# Altium schematic sheet Sheet1.SchDoc: <page title>
size Letter; Author: JRL; Organization: Engenuics Technologies Inc; Address1: 1835 19 Avenue NW; Address2: Calgary, AB  T2M 1B6; Address3: CANADA; Address4: 1-403-998-1422; DocumentNumber: <PPPP-DTTT->; Revision: <###>; SheetNumber: <x>; SheetTotal: <y>
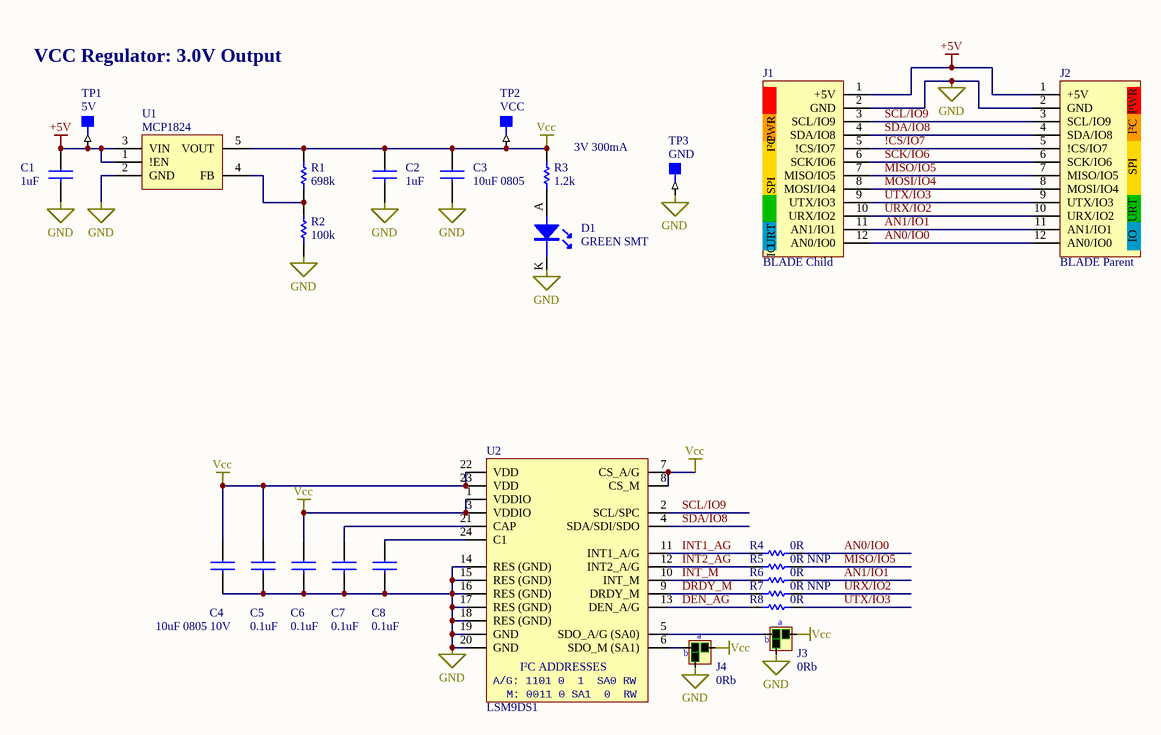
[diagram p0: Sheet1.SchDoc]

## Parts
C1  1uF  [0603]
C2  1uF  [0603]
C3  10uF 0805  [0805]
C4  10uF 0805 10V  [0805]
C5  0.1uF  [0603]
C6  0.1uF  [0603]
C7  0.1uF  [0603]
C8  0.1uF  [0603]
D1  GREEN SMT  [0603 AK]
J1  BLADE Child  [HDR1X12 ENGENUICS CHILD]
J2  BLADE Parent  [HDR1X12 ENGENUICS PARENT]
J3  0Rb  [0603 SELECTOR]
J4  0Rb  [0603 SELECTOR]
R1  698k  [0603]
R2  100k  [0603]
R3  1.2k  [0603]
R4  0R  [0603]
R5  0R NNP  [0603]
R6  0R  [0603]
R7  0R NNP  [0603]
R8  0R  [0603]
TP1  5V  [TEST POINT SMT]
TP2  VCC  [TEST POINT SMT]
TP3  GND  [TEST POINT SMT]
U1  MCP1824  [SOT23-5]
U2  LSM9DS1  [LGA24 3.5 x 3mm LSM9DS1]

## Nets
+5V: C1.1 J1.1(+5V) J2.1(+5V) TP1.1 U1.1(!EN) U1.3(VIN)
GND: C1.2 C2.2 C3.2 C4.2 C5.2 C6.2 C7.2 C8.2 D1.K(K1) J1.2(GND) J2.2(GND) J3.3(OUT2) J4.3(OUT2) R2.2 TP3.1 U1.2(GND) U2.14(RES_(GND)) U2.15(RES_(GND)) U2.16(RES_(GND)) U2.17(RES_(GND)) U2.18(RES_(GND)) U2.19(GND) U2.20(GND)
Vcc: C2.1 C3.1 C4.1 C5.1 C6.1 J3.2(OUT1) J4.2(OUT1) R1.2 R3.2 TP2.1 U1.5(VOUT) U2.1(VDDIO) U2.3(VDDIO) U2.7(CS_A/G) U2.8(CS_M) U2.22(VDD) U2.23(VDD)
!CS/IO7: J1.5(!CS/IO7) J2.5(!CS/IO7)
AN0/IO0: J1.12(AN0/IO0) J2.12(AN0/IO0) R4.1
AN1/IO1: J1.11(AN1/IO1) J2.11(AN1/IO1) R6.1
DEN_AG: R8.2 U2.13(DEN_A/G)
DRDY_M: R7.2 U2.9(DRDY_M)
INT1_AG: R4.2 U2.11(INT1_A/G)
INT2_AG: R5.2 U2.12(INT2_A/G)
INT_M: R6.2 U2.10(INT_M)
MISO/IO5: J1.7(MISO/IO5) J2.7(MISO/IO5) R5.1
MOSI/IO4: J1.8(MOSI/IO4) J2.8(MOSI/IO4)
SCK/IO6: J1.6(SCK/IO6) J2.6(SCK/IO6)
SCL/IO9: J1.3(SCL/IO9) J2.3(SCL/IO9) U2.2(SCL/SPC)
SDA/IO8: J1.4(SDA/IO8) J2.4(SDA/IO8) U2.4(SDA/SDI/SDO)
URX/IO2: J1.10(URX/IO2) J2.10(URX/IO2) R7.1
UTX/IO3: J1.9(UTX/IO3) J2.9(UTX/IO3) R8.1
NetC7_1: C7.1 U2.21(CAP)
NetC8_1: C8.1 U2.24(C1)
NetD1_A: D1.A(A1) R3.1
NetJ3_1: J3.1(IN) U2.5(SDO_A/G_(SA0))
NetJ4_1: J4.1(IN) U2.6(SDO_M_(SA1))
NetR1_1: R1.1 R2.1 U1.4(FB)

## Notes on the sheet
- VCC Regulator: 3.0V Output
- (near R3) 3V 300mA
- 1835 19 AVE NW
- Calgary, AB  T2M 1B6
- Title:
- Number:
- Date:
- Version
- Sheet:
- of
- Author:
- Revision
- History
- Description / Change Summary
- Date Released
- Approved By
- 1-403-998-1422
- File:
- (in symbol CONN ENGENUICS BLADE CHILD) PWR; I²C; SPI; URT; IO
- (in symbol CONN ENGENUICS BLADE PARENT) PWR; I²C; SPI; URT; IO
- (in symbol IC IMU ST LSM9DS1) I²C ADDRESSES; A/G: 1101 0  1  SA0 RW; M: 0011 0 SA1  0  RW
- (in symbol SWITCH RESISTOR SELECTOR) a; b

## Library data of the parts
C1 C2 = CAPACITOR NON-POLARIZED: 3. Manufacturer Part Number: EMK107BJ105KA-T; 2. Manufacturer: Taiyo Yuden; 5. Internal Part Number: 100009; 1. Description: CAP CER 1uF 10% X5R 16V 0603 SMT; 7. Modified By: JRL; 4. Digi-Key Part Number: 587-1251-2-ND; 6. Last Modified: 2011-08-01
C3 C4 = CAPACITOR NON-POLARIZED: 3. Manufacturer Part Number: LMK212BJ106KG-T; 2. Manufacturer: Taiyo; 5. Internal Part Number: 100006; 1. Description: CAP CER 10UF 10V X5R 0805; 7. Modified By: JRL; 4. Digi-Key Part Number: 587-1300-1-ND; 6. Last Modified: 2010-10-11
C5-C8 = CAPACITOR NON-POLARIZED: 3. Manufacturer Part Number: C1608X7R1E104K; 2. Manufacturer: TDK; 5. Internal Part Number: 100130; 1. Description: CAP CER 0.1uF 10% X5R 25V 0603 SMT; 7. Modified By: JRL; 4. Digi-Key Part Number: 445-1316-2-ND; 6. Last Modified: 2018-11-24
D1 = LED T1-3/4: LED; 2. Manufacturer: Lite-on; 3. Manufacturer Part Number: LTST-C190GKT; 5. Internal Part Number: 100065; 1. Description: LED GREEN CLEAR 0603 SMD; 7. Modified By: JRL; 4. Digi-Key Part Number: 160-1183-1-ND; 6. Last Modified: October 18, 2009
J1 = CONN ENGENUICS BLADE CHILD: 2. Manufacturer: FCI; 3. Manufacturer Part Number: 68016-412HLF; 5. Internal Part Number: 100021; 1. Description: CONN HEADER 12POS .100 R/A TIN; 7. Modified By: JRL; 4. Digi-Key Part Number: 609-3330-ND; 6. Last Modified: 2011-08-01
J2 = CONN ENGENUICS BLADE PARENT: 2. Manufacturer: Sullins; 3. Manufacturer Part Number: PPTC121LGBN-RC; 5. Internal Part Number: 100031; 1. Description: CONN TERMINAL 12POS 0.100" RIGHT ANGLE; 7. Modified By: JRL; 4. Digi-Key Part Number: S5448-ND; 6. Last Modified: 2011-04-17
J3 J4 = SWITCH RESISTOR SELECTOR: 2. Manufacturer: Vishay; 3. Manufacturer Part Number: CRCW06030000Z0EA; 5. Internal Part Number: 100075; 1. Description: RES 0.0 OHM 1/10W 1% 0603 SMD; 7. Modified By: JRL; 4. Digi-Key Part Number: 541-0.0GTR-ND; 6. Last Modified: 2018-11-23
R1 = RESISTOR: 2. Manufacturer: Yageo; 3. Manufacturer Part Number: RC0603FR-07698KL; 5. Internal Part Number: 100087; 1. Description: RES 698K OHM 1/10W 1% 0603 SMD; 7. Modified By: JRL; 4. Digi-Key Part Number: 311-698KHRCT-ND; 6. Last Modified: July 4, 2010
R2 = RESISTOR: 2. Manufacturer: Rohm; 3. Manufacturer Part Number: MCR03EZPJ104; 5. Internal Part Number: 100078; 1. Description: RES 100K OHM 1/10W 5% 0603 SMD; 7. Modified By: JRL; 4. Digi-Key Part Number: RHM100KGCT-ND; 6. Last Modified: 2010-10-11
R3 = RESISTOR: 2. Manufacturer: Rohm; 3. Manufacturer Part Number: MCR03EZPJ122; 5. Internal Part Number: 100076; 1. Description: RES 1.2K OHM 1/10W 5% 0603 SMD; 7. Modified By: JRL; 4. Digi-Key Part Number: RHM1.2KGCT-ND; 6. Last Modified: 2010-10-11
R4-R8 = RESISTOR: 2. Manufacturer: Vishay; 3. Manufacturer Part Number: CRCW06030000Z0EA; 5. Internal Part Number: 100075; 1. Description: RES 0.0 OHM 1/10W 1% 0603 SMD; 7. Modified By: JRL; 4. Digi-Key Part Number: 541-0.0GTR-ND; 6. Last Modified: 2018-11-23
TP1-TP3 = TEST POINT SMT: 1. Description: Test pad; 7. Modified By: JRL; 2. Manufacturer: N/A; 3. Manufacturer Part Number: N/A; 4. Digi-Key Part Number: N/A; 5. Internal Part Number: N/A; 6. Last Modified: June 12, 2008
U1 = VREG MCP1824: 2. Manufacturer: Microchip; 3. Manufacturer Part Number: MCP1824T-ADJE/OT; 5. Internal Part Number: 100049; 1. Description: IC LDO REG 300MA ADJ-V SOT23-5; 7. Modified By: JRL; 4. Digi-Key Part Number: MCP1824T-ADJE/OTCT-ND; 6. Last Modified: 2011-04-17
U2 = IC IMU ST LSM9DS1: 2. Manufacturer: STMicroelectronics; 3. Manufacturer Part Number: LSM9DS1TR; 1. Description: IMU ACCEL/GYRO/MAG I2C/SPI 24LGA; 7. Modified By: JRL; 4. Digi-Key Part Number: 497-14946-1-ND; 5. Internal Part Number: *; 6. Last Modified: 2018-11-14